# Altium schematic sheet Codec_board.SchDoc
size A0
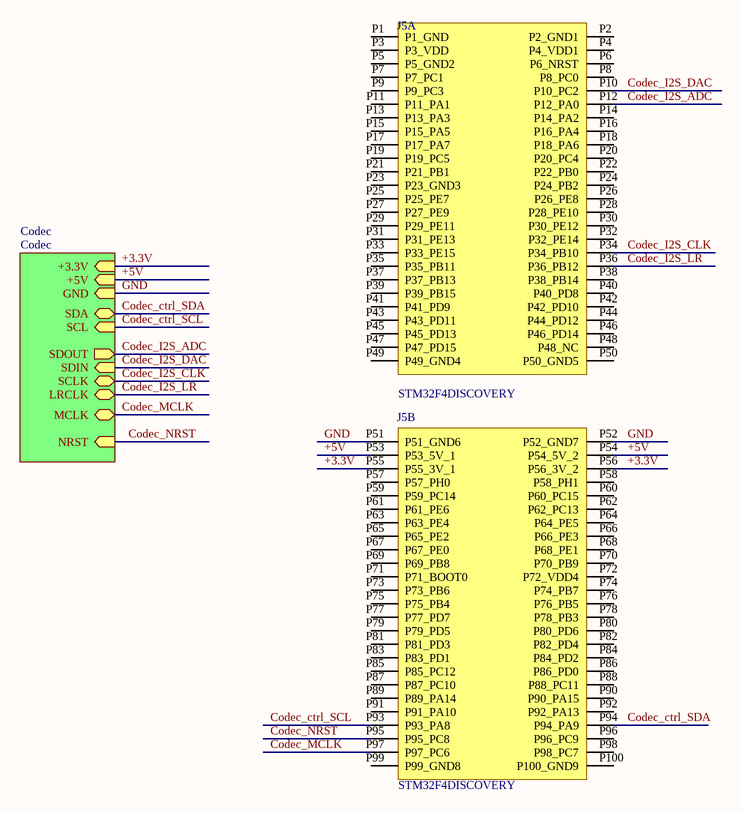
[diagram p0: Codec_board.SchDoc]

## Parts
J5  STM32F4DISCOVERY  [STMICROELECTRONICS_STM32F4DISCOVERY_STM32F4DISCOVERY]  (parts A,B of 2)

## Sub-sheets
Codec = Codec: SDOUT (out), SCLK (bidir), MCLK (bidir), SDA (bidir), SCL (in), +3.3V (in), SDIN (in), GND (in), LRCLK (bidir), +5V (in), NRST (in)

## Nets
+3.3V: J5.P55(P55_3V_1) J5.P56(P56_3V_2) ; sheet Codec/+3.3V
+5V: J5.P53(P53_5V_1) J5.P54(P54_5V_2) ; sheet Codec/+5V
Codec_ctrl_SCL: J5.P93(P93_PA8) ; sheet Codec/SCL
Codec_ctrl_SDA: J5.P94(P94_PA9) ; sheet Codec/SDA
Codec_I2S_ADC: J5.P12(P12_PA0) ; sheet Codec/SDOUT
Codec_I2S_CLK: J5.P34(P34_PB10) ; sheet Codec/SCLK
Codec_I2S_DAC: J5.P10(P10_PC2) ; sheet Codec/SDIN
Codec_I2S_LR: J5.P36(P36_PB12) ; sheet Codec/LRCLK
Codec_MCLK: J5.P97(P97_PC6) ; sheet Codec/MCLK
Codec_NRST: J5.P95(P95_PC8) ; sheet Codec/NRST
GND: J5.P51(P51_GND6) J5.P52(P52_GND7) ; sheet Codec/GND

Not connected (* = marked no-connect by the designer): J5 P1(P1_GND) P2(P2_GND1) P3(P3_VDD) P4(P4_VDD1) P5(P5_GND2) P6(P6_NRST) P7(P7_PC1) P8(P8_PC0) P9(P9_PC3) P11(P11_PA1) P13(P13_PA3) P14(P14_PA2) P15(P15_PA5) P16(P16_PA4) P17(P17_PA7) P18(P18_PA6) P19(P19_PC5) P20(P20_PC4) P21(P21_PB1) P22(P22_PB0) P23(P23_GND3) P24(P24_PB2) P25(P25_PE7) P26(P26_PE8) P27(P27_PE9) P28(P28_PE10) P29(P29_PE11) P30(P30_PE12) P31(P31_PE13) P32(P32_PE14) P33(P33_PE15) P35(P35_PB11) P37(P37_PB13) P38(P38_PB14) P39(P39_PB15) P40(P40_PD8) P41(P41_PD9) P42(P42_PD10) P43(P43_PD11) P44(P44_PD12) P45(P45_PD13) P46(P46_PD14) P47(P47_PD15) P48(P48_NC) P49(P49_GND4) P50(P50_GND5) P57(P57_PH0) P58(P58_PH1) P59(P59_PC14) P60(P60_PC15) P61(P61_PE6) P62(P62_PC13) P63(P63_PE4) P64(P64_PE5) P65(P65_PE2) P66(P66_PE3) P67(P67_PE0) P68(P68_PE1) P69(P69_PB8) P70(P70_PB9) P71(P71_BOOT0) P72(P72_VDD4) P73(P73_PB6) P74(P74_PB7) P75(P75_PB4) P76(P76_PB5) P77(P77_PD7) P78(P78_PB3) P79(P79_PD5) P80(P80_PD6) P81(P81_PD3) P82(P82_PD4) P83(P83_PD1) P84(P84_PD2) P85(P85_PC12) P86(P86_PD0) P87(P87_PC10) P88(P88_PC11) P89(P89_PA14) P90(P90_PA15) P91(P91_PA10) P92(P92_PA13) P96(P96_PC9) P98(P98_PC7) P99(P99_GND8) P100(P100_GND9)

## Library data of the parts
J5 = STM32F4DISCOVERY: Development kit: ARM ST; pin strips, pin header; No.of; MF: STMicroelectronics; MP: STM32F4DISCOVERY; Availability: Unavailable; SnapEDA_Link: https://www.snapeda.com/parts/STM32F4DISCOVERY/STMicroelectronics/view-part/?ref=snap; Package: None; Price: None; Value: *